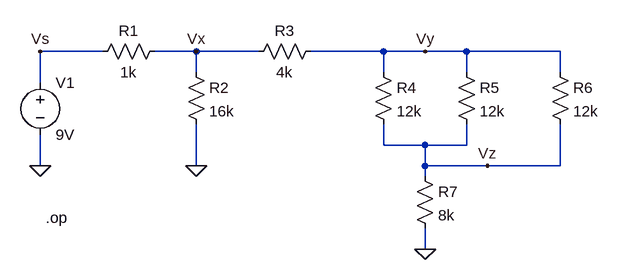
[diagram p0: schematic resistors+sources-1.asc]
resistors+sources-1.asc, the LTspice schematic file:
Version 4
SHEET 1 880 680
WIRE -16 192 -112 192
WIRE 128 192 64 192
WIRE 224 192 128 192
WIRE 416 192 304 192
WIRE 480 192 416 192
WIRE 544 192 480 192
WIRE 688 192 544 192
WIRE 128 224 128 192
WIRE 416 224 416 192
WIRE 544 224 544 192
WIRE 688 224 688 192
WIRE -112 240 -112 192
WIRE 416 336 416 304
WIRE 480 336 416 336
WIRE 544 336 544 304
WIRE 544 336 480 336
WIRE -112 368 -112 320
WIRE 128 368 128 304
WIRE 480 368 480 336
WIRE 576 368 480 368
WIRE 688 368 688 304
WIRE 688 368 576 368
WIRE 480 384 480 368
WIRE 480 496 480 464
FLAG 480 496 0
FLAG 128 368 0
FLAG -112 368 0
FLAG 128 192 Vx
FLAG -112 192 Vs
FLAG 480 192 Vy
FLAG 576 368 Vz
SYMBOL voltage -112 224 R0
SYMATTR InstName V1
SYMATTR Value 9V
SYMBOL res -32 208 R270
WINDOW 0 32 56 VTop 2
WINDOW 3 0 56 VBottom 2
SYMATTR InstName R1
SYMATTR Value 1k
SYMBOL res 112 208 R0
SYMATTR InstName R2
SYMATTR Value 16k
SYMBOL res 208 208 R270
WINDOW 0 32 56 VTop 2
WINDOW 3 0 56 VBottom 2
SYMATTR InstName R3
SYMATTR Value 4k
SYMBOL res 400 208 R0
SYMATTR InstName R4
SYMATTR Value 12k
SYMBOL res 528 208 R0
SYMATTR InstName R5
SYMATTR Value 12k
SYMBOL res 672 208 R0
SYMATTR InstName R6
SYMATTR Value 12k
SYMBOL res 464 368 R0
SYMATTR InstName R7
SYMATTR Value 8k
TEXT -104 448 Left 2 !.op

The netlist it stands for:
* resistors+sources-1.asc
V1 Vs 0 9V
R1 Vs Vx 1k
R2 Vx 0 16k
R3 Vx Vy 4k
R4 Vy Vz 12k
R5 Vy Vz 12k
R6 Vy Vz 12k
R7 Vz 0 8k
.op
.backanno
.end